# EAGLE design wiLED (EAGLE 9.6.1)
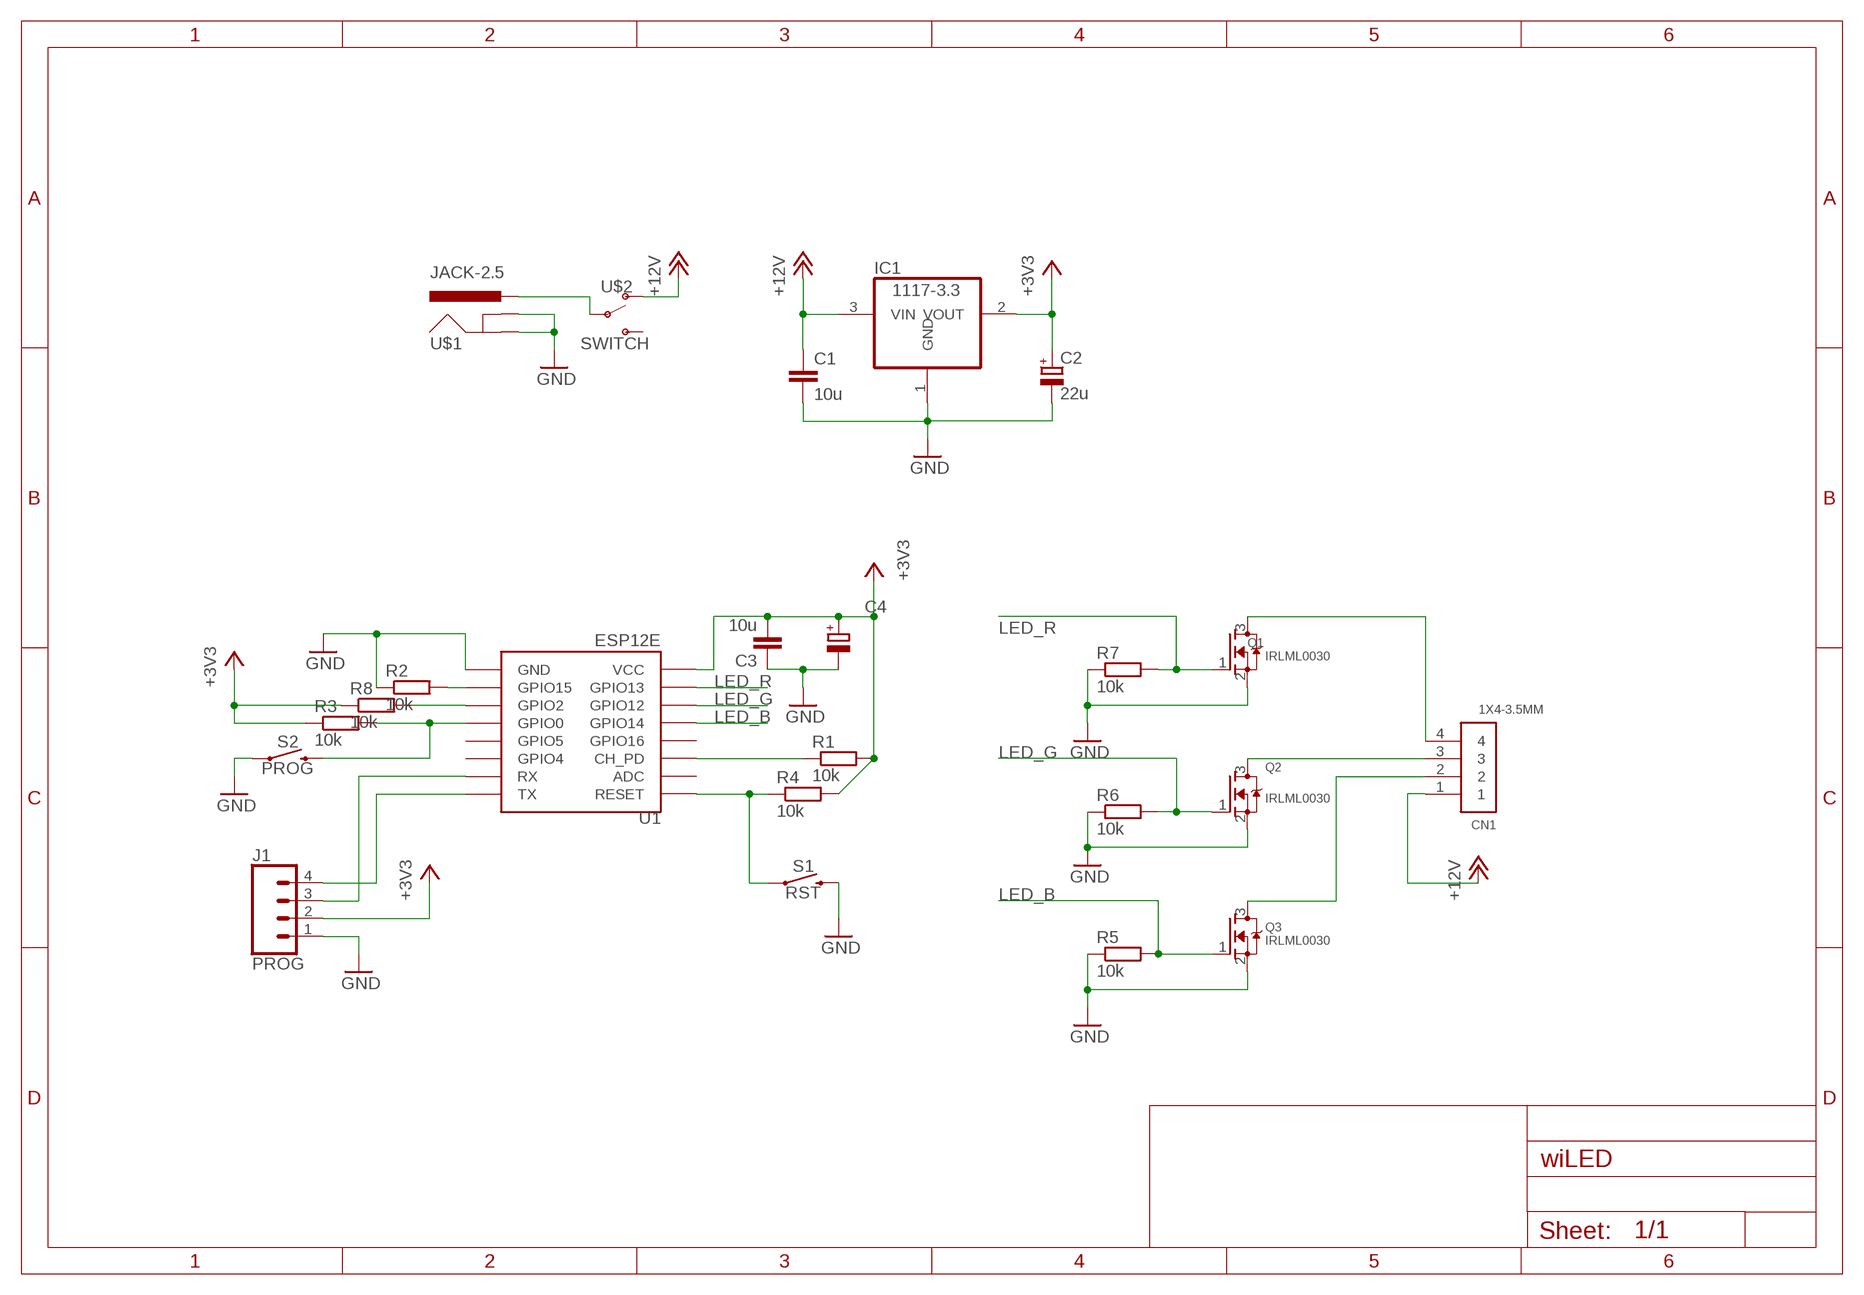
[diagram p0: schematic, sheet 1]

## Parts
C1  10u  C-EUC0805  [C0805]
C2  22u  CPOL-EUSMCA  [SMC_A]
C3  10u  C-EUC0805  [C0805]
C4  CPOL-EUSMCC  [SMC_C]
CN1  1X4-3.5MM  [1X04-3.5MM]
IC1  1117-3.3  REG1117  [SOT223]
J1  PROG  CONN_04  [1X04]
Q1  IRLML0030  MOSFET-NREFLOW  [SOT23]
Q2  IRLML0030  MOSFET-NREFLOW  [SOT23]
Q3  IRLML0030  MOSFET-NREFLOW  [SOT23]
R1  10k  R-EU_M0805  [M0805]
R2  10k  R-EU_M0805  [M0805]
R3  10k  R-EU_M0805  [M0805]
R4  10k  R-EU_M0805  [M0805]
R5  10k  R-EU_M0805  [M0805]
R6  10k  R-EU_M0805  [M0805]
R7  10k  R-EU_M0805  [M0805]
R8  10k  R-EU_M0805  [M0805]
S1  RST  MOMENTARY-SWITCH-SPST-SMD-6.0X3.5MM  [TACTILE_SWITCH_SMD_6.0X3.5MM]
S2  PROG  MOMENTARY-SWITCH-SPST-SMD-6.0X3.5MM  [TACTILE_SWITCH_SMD_6.0X3.5MM]
U1  ESP12E  ESP12SMD  [ESP12-SMD]
U$1  JACK-2.5  [DC-2.5]
U$2  SWITCH  [SWITCH]

## Nets
+3V3 [low power]: C2.+ C3.2 C4.+ IC1.2(VOUT) J1.2 R1.2 R3.1 R4.2 R8.1 U1.VCC
+12V [high power]: C1.1 CN1.1 IC1.3(VIN) U$2.P$1(O)
GND [high power]: C1.2 C2.- C3.1 C4.- IC1.1(GND) J1.1 Q1.2(S) Q2.2(S) Q3.2(S) R2.1 R5.1 R6.1 R7.1 S1.2 S2.1 U1.GND U$1.P$1(GND) U$1.P$3(GNDBREAK)
LED_B: Q3.1(G) R5.2 U1.GPIO14
LED_G: Q2.1(G) R6.2 U1.GPIO12
LED_R: Q1.1(G) R7.2 U1.GPIO13
N$1 [high power]: U$1.P$2(PWR) U$2.P$2(P)
N$2: R2.2 U1.GPIO15
N$3: R3.2 S2.2 U1.GPIO0
N$4 [low power]: CN1.4 Q1.3(D)
N$5: R1.1 U1.CH_PD
N$7 [low power]: CN1.3 Q2.3(D)
N$8: J1.3 U1.RXD0(RX)
N$9: J1.4 U1.TXD0(TX)
N$10 [low power]: CN1.2 Q3.3(D)
N$11: R8.2 U1.GPIO2
N$16: R4.1 S1.1 U1.RESET
Unconnected: U1.ADC U1.GPIO4 U1.GPIO5 U1.GPIO16 U$2.P$3(S)

## Library data of the parts
C1 C3 = rcl:C-EU: CAPACITOR, European symbol; SPICEPREFIX: C
C2 C4 = rcl:CPOL-EU: POLARIZED CAPACITOR, European symbol; SPICEPREFIX: C
CN1 = adafruit:1X4: 4-pin connector
IC1 = burr-brown:REG1117: 800mA and 1A Low Dropout (LDO) Positive Regulator 1.8V, 2.5V, 2.85V, 3.3V, 5V, and Adj; MPN: REG1117; OC_FARNELL: 1097566; OC_NEWARK: 14P6981
J1 = SparkFun-Connectors:CONN_04: Multi connection point. Often used as Generic Header-pin footprint for 0.1 inch spaced/style header connections On any of the 0.1 inch spaced packages, you can populate with these: Break Away Headers - Straight <https://www.sparkfun.com/products/116> (PRT-00116) Break Away Male Headers - Right Angle <https://www.sparkfun.com/products/553> (PRT-00553) Female Headers <https://www.sparkfun.com/products/115> (PRT-00115) Break Away Headers - Machine Pin <https://www.sparkfun.com/products/117> (PRT-00117) Break Away Female Headers - Swiss Machine Pin <https://www.sparkfun.com/products/743> (PRT-00743) For SCREWTERMINALS and SPRING TERMINALS visit here: Screw Terimnals on SparkFun.com <https://www.sparkfun.com/search/results?term=Screw+Terminals> (5mm/3.5mm/2.54mm spacing) This device is also useful as a general connection point to wire up your design to another part of your project. Our various solder wires solder well into these plated through hole pads. Hook-Up Wire - Assortment (Stranded, 22 AWG) <https://www.sparkfun.com/products/11375> (PRT-11375) Hook-Up Wire - Assortment (Solid Core, 22 AWG) <https://www.sparkfun.com/products/11367> (PRT-11367) View the entire wire category on our website here <https://www.sparkfun.com/categories/141> Special notes: Molex polarized connector foot print use with SKU : PRT-08231 with associated crimp pins and housings. 1MM SMD Version SKU: PRT-10208; PROD_ID: CONN-09696
Q1-Q3 = adafruit:MOSFET-N: N-Channel Mosfet 2N7002E - 60V 260mA SOT23 [Digikey: 2N7002ET1GOSTR-ND] - REEL BSH103 - 30V 850mA SOT23 [Digikey: 568-5013-1-ND]
R1-R8 = rcl:R-EU_: RESISTOR, European symbol; SPICEPREFIX: R
S1 S2 = SparkFun-Switches:MOMENTARY-SWITCH-SPST: Momentary Switch (Pushbutton) - SPST Normally-open (NO) SPST momentary switches (buttons, pushbuttons). Variants PTH-12MM - 12mm square, through-hole Momentary Pushbutton Switch - 12mm Square <https://www.sparkfun.com/products/9190> (COM-09190) PTH-6.0MM, PTH-6.0MM-KIT - 6.0mm square, through-hole Mini Pushbutton Switch <https://www.sparkfun.com/products/97> (COM-00097) KIT package intended for soldering kit's - only one side of pads' copper is exposed. PTH-RIGHT-ANGLE-KIT - Right-angle, through-hole Right Angle Tactile Button <https://www.sparkfun.com/products/10791> - Used on SparkFun BigTime Watch Kit <https://www.sparkfun.com/products/11734> SMD-12MM - 12mm square, surface-mount Tactile Button - SMD (12mm) <https://www.sparkfun.com/products/12993> (COM-12993) Used on SparkFun PicoBoard <https://www.sparkfun.com/products/11888> SMD-4.5MM - 4.5mm Square Trackball Switch Used on SparkFun Blackberry Trackballer Breakout <https://www.sparkfun.com/products/13169> SMD-4.6MMX2.8MM - 4.60mm x 2.80mm, surface mount Used on SparkFun SAMD21 Mini Breakout <https://www.sparkfun.com/products/13664> SMD-5.2MM, SMD-5.2-REDUNDANT - 5.2mm square, surface-mount Mini Pushbutton Switch - SMD <https://www.sparkfun.com/products/8720> (COM-08720) Used on Arduino Pro Mini <https://www.sparkfun.com/products/11114> REDUNDANT package connects both switch circuits together SMD-6.0X3.5MM - 6.0 x 3.5mm, surface mount Momentary Reset Switch SMD <https://www.sparkfun.com/products/8229> (COM-08229) SMD-6.2MM-TALL - 6.2mm square, surface mount Tactile Button - SMD (6mm) <https://www.sparkfun.com/products/12992> Used on SparkFun Digital Sandbox <https://www.sparkfun.com/products/12651> SMD-RIGHT-ANGLE - Right-angle, surface mount Used on SparkFun Block for Intel® Edison - Arduino <https://www.sparkfun.com/products/13036>; PROD_ID: SWCH-00815; SF_SKU: COM-08229
U1 = esp8266modules:ESP12: ESP8266 Wifi module 12
U$1 = mylib:JACK-2.5
U$2 = mylib:SWITCH

## Net classes
0 default: width 0.203 mm
1 high power: width 0.762 mm
2 low power: width 0.254 mm

## Board
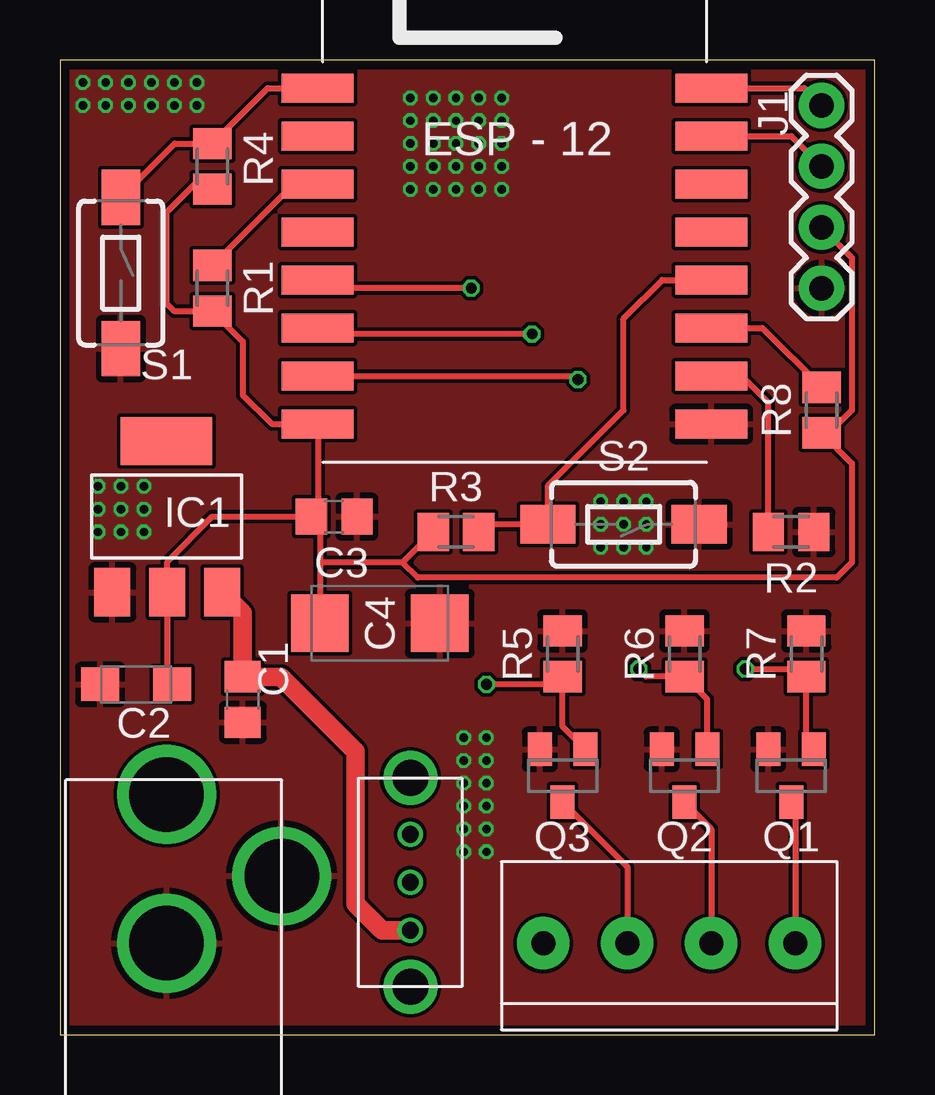
[diagram p1: board, top side]
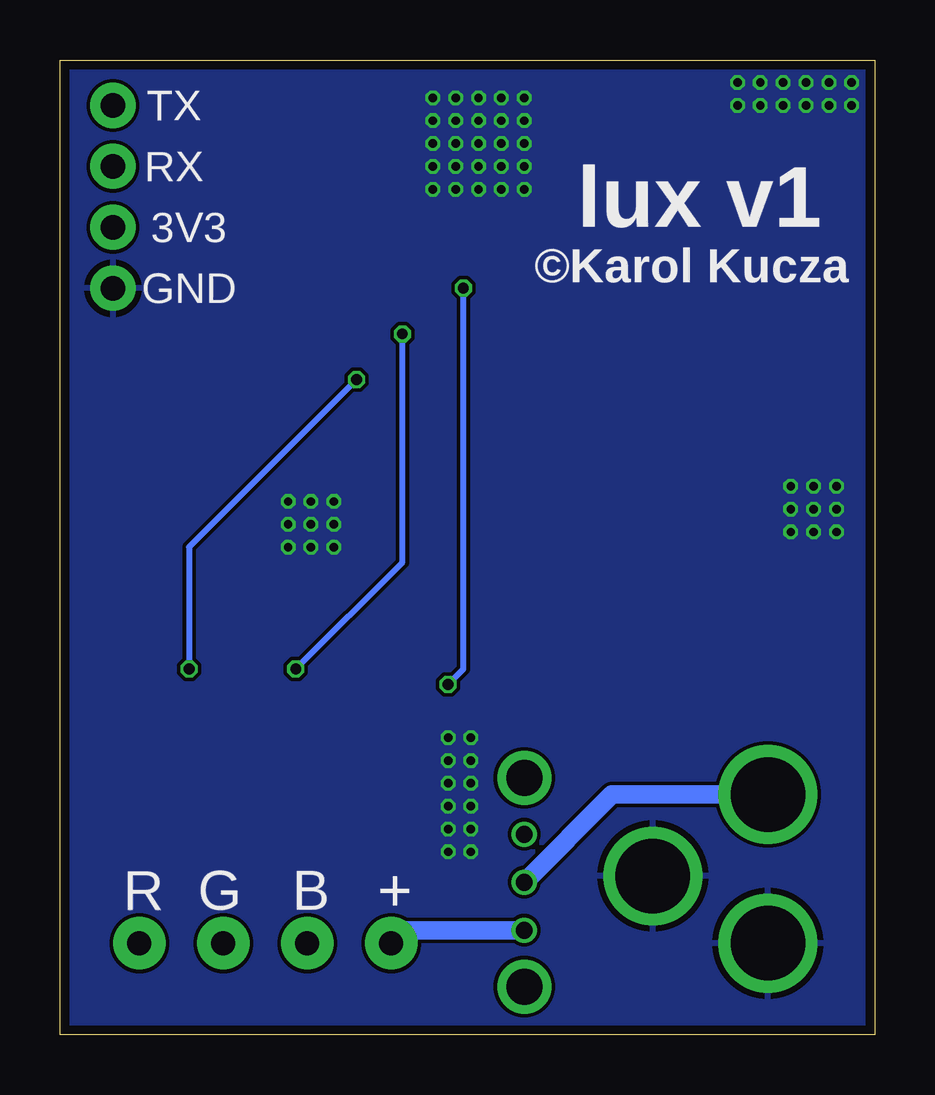
[diagram p2: board, bottom side, seen from below]

Size 33.96 x 40.63 mm. Coordinates in mm from the lower left corner, seen from the top.
Outline: 0,0 33.96,0 33.96,40.63 0,40.63 0,0
Copper layers (1*16): Top 0.035559375mm / dielectric 1.6mm / Bottom 0.035559375mm
Design rules "oshpark-2layer *": minimum track width 6mil, minimum drill 10mil, track to track 6mil, track to pad 6mil, pad to pad 6mil, via to via 6mil, smd to smd 6mil, copper to edge 15mil, drill to drill 6mil, minimum pad ring 5mil, minimum via ring 5mil, stop-mask expansion 0mil, vias tented up to drill 0mil, thermal gap 10mil

### Footprints (pad centres in the part's own frame; a part is rotated, then mirrored left to right if it is on the bottom)
C0805 = smd 1.3 x 1.5: 1 -0.95,0; 2 0.95,0
SMC_A = smd 1.6 x 1.4: + -1.5,0; - 1.5,0
SMC_C = smd 2.4 x 2.4: + -2.5,0; - 2.5,0
1X04-3.5MM = drill 1 pad 2.184: 1 -5.25,0; 2 -1.75,0; 3 1.75,0; 4 5.25,0
SOT223 = smd 1.499 x 2.007: 1 -2.261,-3.15; 2 0.025,-3.15; 3 2.311,-3.15 | smd 3.81 x 2.007: 4 0,3.15
1X04 = drill 1.016 pad 1.88: 1 0,0; 2 2.54,0; 3 5.08,0; 4 7.62,0
SOT23 = smd 1 x 1.4: 1 -0.95,-1.1; 2 0.95,-1.1; 3 0,1.1
M0805 = smd 1.3 x 1.6: 1 -0.95,0; 2 0.95,0
TACTILE_SWITCH_SMD_6.0X3.5MM = smd 2.3 x 1.6: 1 -3.15,0; 2 3.15,0
ESP12-SMD = smd 3 x 1.2: ADC -8.3,3.8; CH_PD -8.3,1.8; GND 8.1,-8.2; GPIO0 8.1,-2.2; GPIO2 8.1,-4.2; GPIO4 8.1,1.8; GPIO5 8.1,-0.2; GPIO12 -8.3,-4.2; GPIO13 -8.3,-6.2; GPIO14 -8.3,-2.2; GPIO15 8.1,-6.2; GPIO16 -8.3,-0.2; RESET -8.3,5.8; RXD0 8.1,3.8; TXD0 8.1,5.8; VCC -8.3,-8.2
DC-2.5 = drill 3.1: P$1 0,0; P$2 6.2,0; P$3 2.8,-4.8
SWITCH = drill 0.7: P$1 -2,0; P$2 0,0; P$3 2,0 | drill 1.5: P$4 -4.35,0; P$5 4.35,0

### Placement (x,y rotation side)
C1  7.62,13.97 270 top
C2  3.17,14.61 180 top
C3  11.43,21.59 180 top
C4  13.34,17.14 0 top
CN1  25.4,3.81 0 top
IC1  4.45,21.59 0 top
J1  31.75,31.11 90 top
Q1  30.48,10.79 180 top
Q2  26.04,10.79 180 top
Q3  20.95,10.79 180 top
R1  6.35,31.11 270 top
R2  30.48,20.95 180 top
R3  16.51,20.95 0 top
R4  6.35,36.2 270 top
R5  20.95,15.88 270 top
R6  26.04,15.88 270 top
R7  31.11,15.88 270 top
R8  31.75,26.04 90 top
S1  2.54,31.75 270 top
S2  23.49,21.27 180 top
U1  19.05,33.66 0 top
U$1  4.45,3.81 90 top
U$2  14.61,6.35 90 top

### Tracks (layer width: path | path; a pad name or v marks a point on that pad's centre or on a via)
+3V3
  Top 0.254: C3.2 6.35,21.59 4.47,19.71 IC1.2 4.47,14.61 C2.+ | C3.2 10.84,21.23 10.84,19.68 | 10.84,19.68 C4.+ | C3.2 10.75,21.86 U1.VCC 8.84,25.45 7.62,26.67 7.62,28.89 R1.2 4.76,30.16 4.45,30.48 4.45,34.29 5.71,35.56 6.04,35.56 R4.2 | R3.1 14.29,19.68 | 14.29,19.68 10.84,19.68 | J1.2 33.02,32.38 33.02,26.04 31.75,24.77 R8.1 33.02,23.82 33.02,19.68 32.39,19.05 14.93,19.05 14.29,19.68
+12V
  Top 0.762: IC1.3 7.62,17.58 C1.1 9.21,14.92 12.32,11.81 12.32,5.46 13.43,4.35 U$2.P$1
  Bottom 0.762: U$2.P$1 19.61,4.35 CN1.1
GND  (via drill 0.35)
  other vias: 14.61,39.05 15.56,39.05 16.51,39.05 17.46,39.05 18.41,39.05 18.41,38.1 17.46,38.1 16.51,38.1 15.56,38.1 14.61,38.1 14.61,37.15 15.56,37.15 16.51,37.15 17.46,37.15 18.41,37.15 18.41,36.2 18.41,35.24 17.46,35.24 16.51,35.24 15.56,35.24 14.61,35.24 14.61,36.2 15.56,36.2 16.51,36.2 17.46,36.2 16.83,12.38 17.78,12.38 16.83,11.43 17.78,11.43 16.83,10.48 17.78,10.48 16.83,9.53 17.78,9.53 17.78,8.57 16.83,8.57 16.83,7.62 17.78,7.62 22.54,22.23 23.49,22.23 24.45,22.23 24.45,21.27 24.45,20.32 23.49,20.32 22.54,20.32 22.54,21.27 23.49,21.27 1.59,22.86 2.54,22.86 1.59,21.91 1.59,20.95 2.54,20.95 2.54,21.91 3.49,22.86 3.49,21.91 3.49,20.95 0.95,39.69 1.91,39.69 2.86,39.69 3.81,39.69 4.76,39.69 5.71,39.69 5.71,38.73 4.76,38.73 3.81,38.73 2.86,38.73 1.91,38.73 0.95,38.73
  pour Top: 0,40.64 33.66,40.64 33.66,0 0,0
  pour Bottom: 0,40.64 33.66,40.64 33.66,0 0,0
LED_B  (via drill 0.45)
  Top 0.254: Q3.1 20.95,12.85 R5.2 20.63,14.61 v17.78,14.61 | v17.14,31.11 11.09,31.11 U1.GPIO14
  Bottom 0.254: v17.78,14.61 17.14,15.24 v17.14,31.11
LED_G  (via drill 0.45)
  Top 0.254: Q2.1 26.98,13.97 R6.2 24.44,14.93 v24.13,15.24 | v19.68,29.21 11,29.21 U1.GPIO12
  Bottom 0.254: v24.13,15.24 19.68,19.68 v19.68,29.21
LED_R  (via drill 0.45)
  Top 0.254: Q1.1 31.11,12.21 31.11,14.61 | 31.11,14.61 R7.2 | U1.GPIO13 21.44,27.45 v21.59,27.3 | v28.57,15.24 30.48,15.24 31.11,14.61
  Bottom 0.254: v21.59,27.3 28.57,20.32 v28.57,15.24
N$1
  Bottom 0.762: U$2.P$2 10.95,10.01 U$1.P$2
N$2
  Top 0.254: R2.2 29.53,26.35 28.42,27.45 U1.GPIO15
N$3
  Top 0.254: R3.2 17.78,21.27 S2.2 20.34,22.89 23.49,26.04 23.49,29.84 25.1,31.45 U1.GPIO0
N$4
  Top 0.254: Q1.3 30.65,9.53 CN1.4
N$5
  Top 0.254: U1.CH_PD 9.74,35.45 R1.1
N$7
  Top 0.254: Q2.3 27.15,8.58 CN1.3
N$8
  Top 0.254: U1.RXD0 30.49,37.45 J1.3
N$9
  Top 0.254: U1.TXD0 31.03,39.45 J1.4
N$10
  Top 0.254: Q3.3 23.65,7 CN1.2
N$11
  Top 0.254: U1.GPIO2 29.28,29.45 R8.2
N$16
  Top 0.254: U1.RESET 8.66,39.45 R4.1 4.79,37.15 S1.1

### Text on the board
bPlace: lux v1 | ©Karol Kucza
bNames: TX | RX | 3V3 | GND | + | B | G | R